# EAGLE design Go!Copter (EAGLE 6.1)
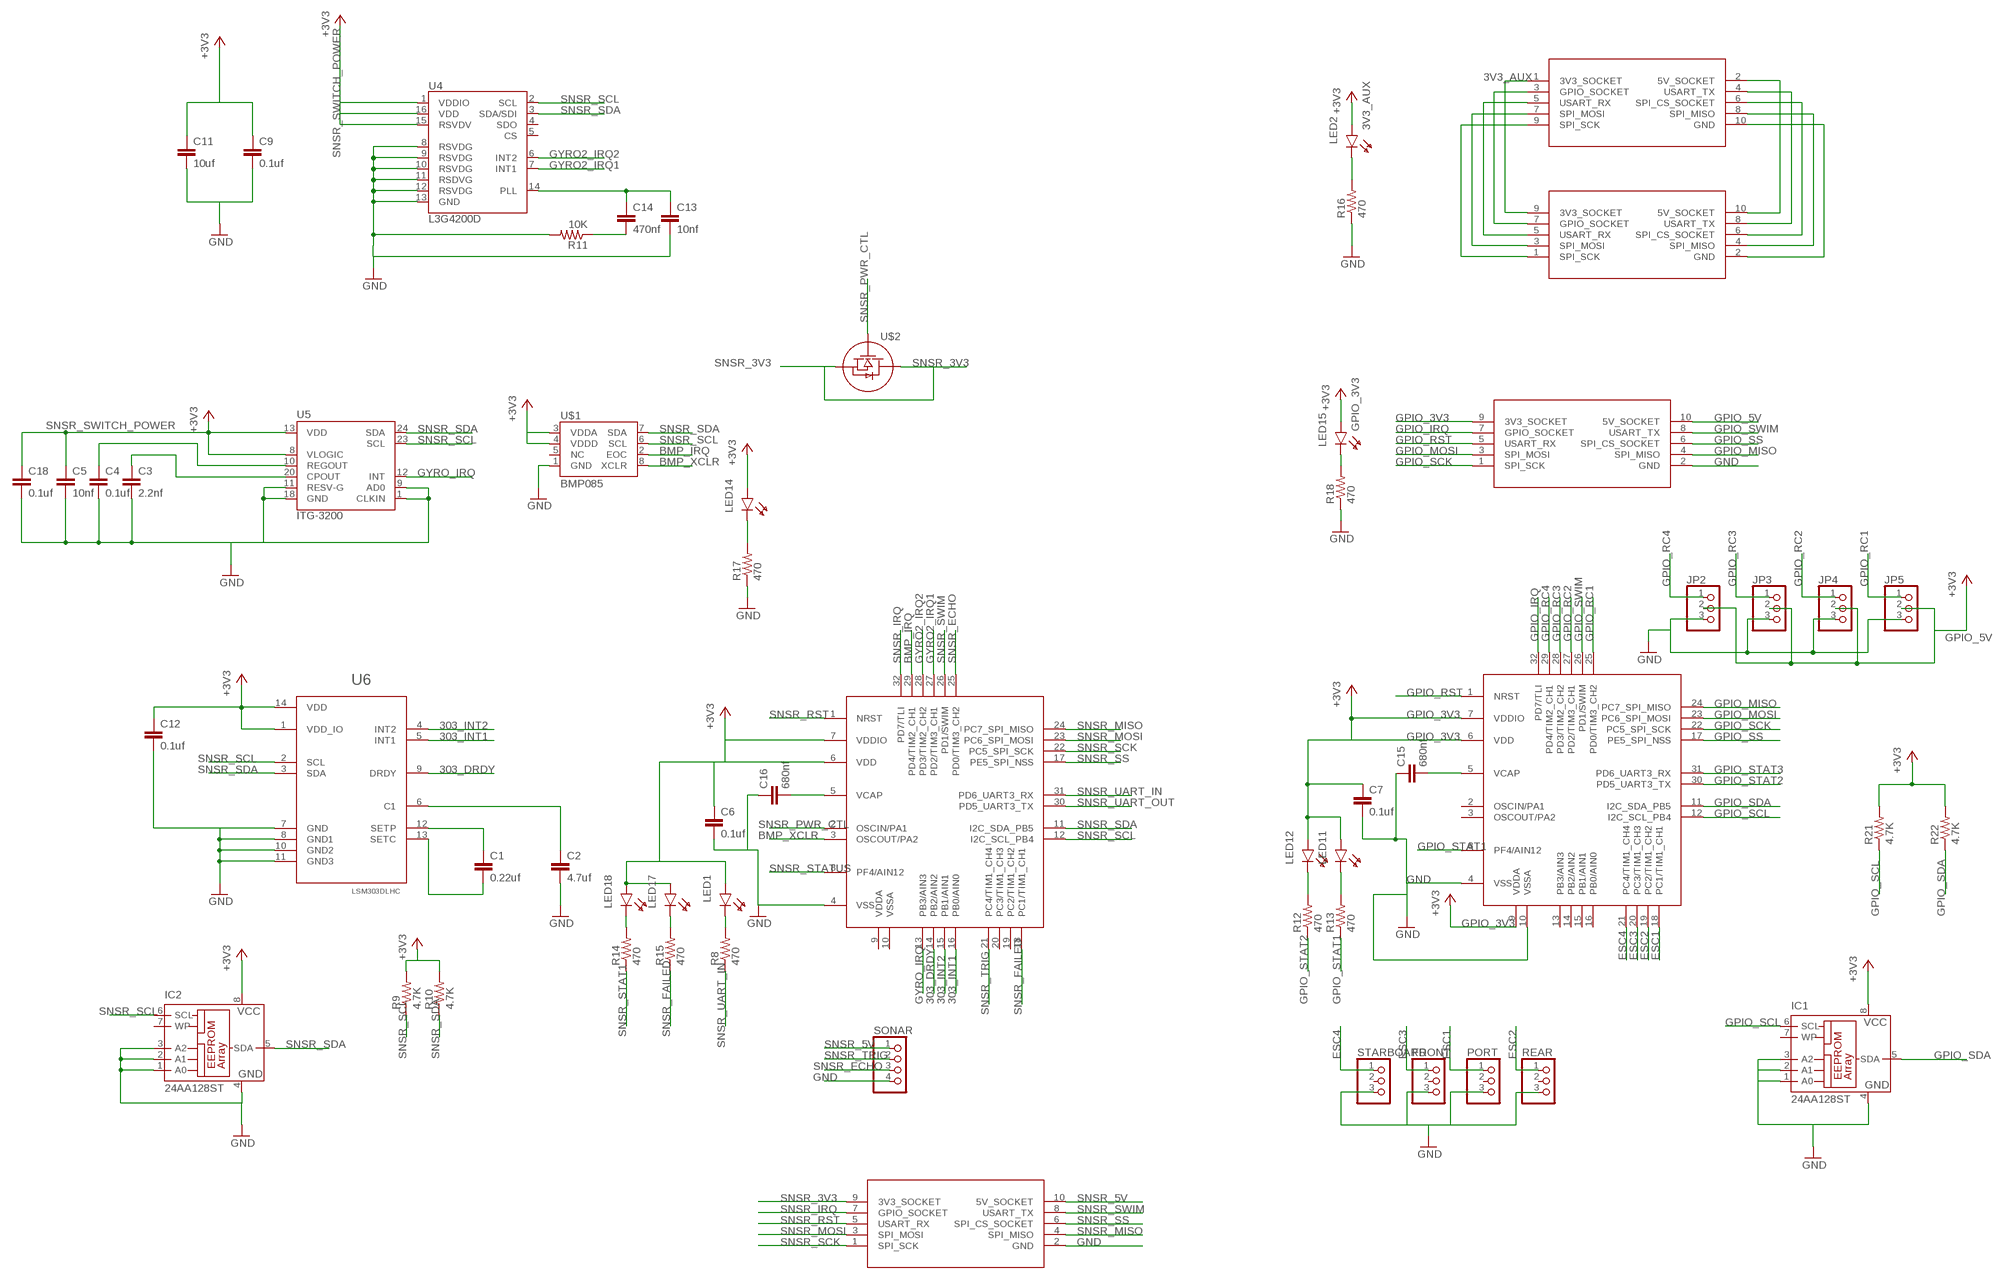
[diagram p0: schematic, sheet 1, part 1 of 2]
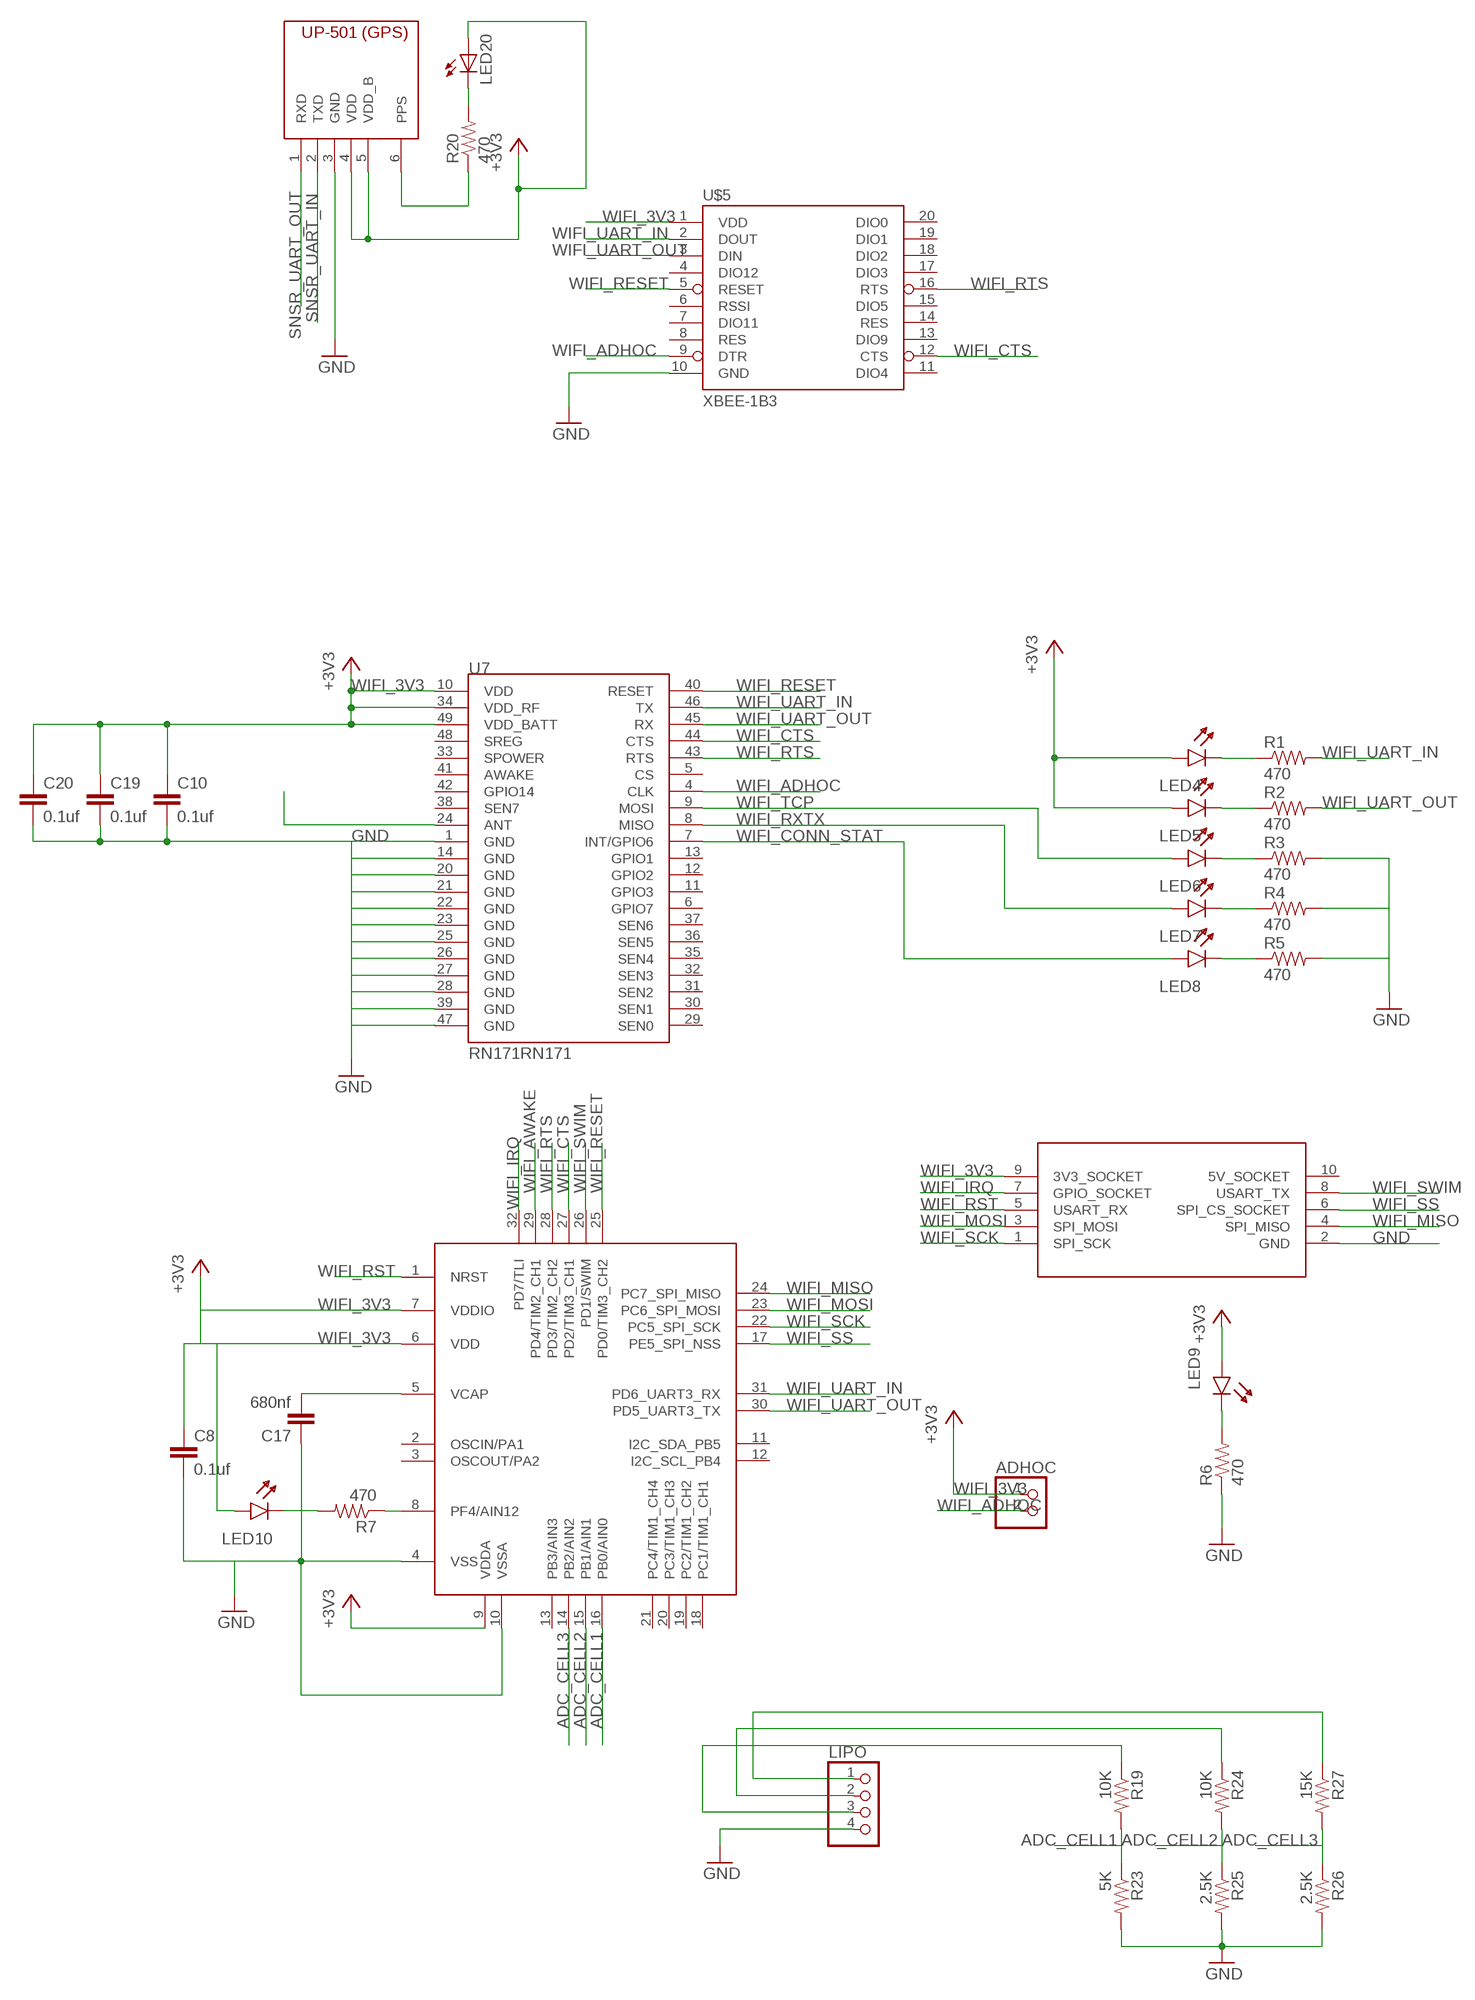
[diagram p1: schematic, sheet 1, part 2 of 2]

## Parts
ADHOC  PINHD-1X2  [1X02]
C1  0.22uf  CAP0805  [0805]
C2  4.7uf  CAP0805  [0805]
C3  2.2nf  CAP0805  [0805]
C4  0.1uf  CAP0805  [0805]
C5  10nf  CAP0805  [0805]
C6  0.1uf  CAP0805  [0805]
C7  0.1uf  CAP0805  [0805]
C8  0.1uf  CAP0805  [0805]
C9  0.1uf  CAP0805  [0805]
C10  0.1uf  CAP0805  [0805]
C11  10uf  CAP0805  [0805]
C12  0.1uf  CAP0805  [0805]
C13  10nf  CAP0805  [0805]
C14  470nf  CAP0805  [0805]
C15  680nf  CAP0805  [0805]
C16  680nf  CAP0805  [0805]
C17  680nf  CAP0805  [0805]
C18  0.1uf  CAP0805  [0805]
C19  0.1uf  CAP0805  [0805]
C20  0.1uf  CAP0805  [0805]
FRONT  PINHD-1X3  [1X03]
IC1  24AA128ST  [TSSOP8]
IC2  24AA128ST  [TSSOP8]
JP2  PINHD-1X3  [1X03]
JP3  PINHD-1X3  [1X03]
JP4  PINHD-1X3  [1X03]
JP5  PINHD-1X3  [1X03]
LED1  SMD_LED0805  [LED0805]
LED2  SMD_LED0805  [LED0805]
LED4  SMD_LED0805  [LED0805]
LED5  SMD_LED0805  [LED0805]
LED6  SMD_LED0805  [LED0805]
LED7  SMD_LED0805  [LED0805]
LED8  SMD_LED0805  [LED0805]
LED9  SMD_LED0805  [LED0805]
LED10  SMD_LED0805  [LED0805]
LED11  SMD_LED0805  [LED0805]
LED12  SMD_LED0805  [LED0805]
LED14  SMD_LED0805  [LED0805]
LED15  SMD_LED0805  [LED0805]
LED17  SMD_LED0805  [LED0805]
LED18  SMD_LED0805  [LED0805]
LED20  LEDCHIPLED_0805  [CHIPLED_0805]
LIPO  PINHD-1X4  [1X04]
PORT  PINHD-1X3  [1X03]
R1  470  RESISTOR0805-RES  [0805]
R2  470  RESISTOR0805-RES  [0805]
R3  470  RESISTOR0805-RES  [0805]
R4  470  RESISTOR0805-RES  [0805]
R5  470  RESISTOR0805-RES  [0805]
R6  470  RESISTOR0805-RES  [0805]
R7  470  RESISTOR0805-RES  [0805]
R8  470  RESISTOR0805-RES  [0805]
R9  4.7K  RESISTOR0805-RES  [0805]
R10  4.7K  RESISTOR0805-RES  [0805]
R11  10K  RESISTOR0805-RES  [0805]
R12  470  RESISTOR0805-RES  [0805]
R13  470  RESISTOR0805-RES  [0805]
R14  470  RESISTOR0805-RES  [0805]
R15  470  RESISTOR0805-RES  [0805]
R16  470  RESISTOR0805-RES  [0805]
R17  470  RESISTOR0805-RES  [0805]
R18  470  RESISTOR0805-RES  [0805]
R19  10K  RESISTOR0805-RES  [0805]
R20  470  RESISTOR0805-RES  [0805]
R21  4.7K  RESISTOR0805-RES  [0805]
R22  4.7K  RESISTOR0805-RES  [0805]
R23  5K  RESISTOR0805-RES  [0805]
R24  10K  RESISTOR0805-RES  [0805]
R25  2.5K  RESISTOR0805-RES  [0805]
R26  2.5K  RESISTOR0805-RES  [0805]
R27  15K  RESISTOR0805-RES  [0805]
REAR  PINHD-1X3  [1X03]
SONAR  PINHD-1X4  [1X04]
STARBOARD  PINHD-1X3  [1X03]
U1  STM8S207K6  [LQFP32]
U2  STM8S207K6  [LQFP32]
U3  STM8S207K6  [LQFP32]
U4  L3G4200D  [LGA16-4X4]
U5  ITG-3200  [QFN-24]
U6  LSM303DLHC  [LGA3X5X1-14L]
U7  RN171RN171  [RN171]
U$1  BMP085  [BMP085]
U$2  MOSFET-BSS138  [SOT-23]
U$3  GO!BUS-FEMALE  [PIN2ROW_0.05"]
U$4  GO!BUS-FEMALE  [PIN2ROW_0.05"]
U$5  XBEE-1B3  [XBEE-SMD]
U$6  UP501  [UP-501]
U$7  GO!BUS-FEMALE  [PIN2ROW_0.05"]
U$8  GO!BUS-FEMALE  [PIN2ROW_0.05"]
U$9  GO!BUS  [PIN2ROW_0.05"]

## Nets
3V3_AUX: LED2.P$1(A) U$8.9(3V3_SOCKET) U$9.1(3V3_SOCKET) ; supply symbol labelled +3V3
5V_AUX: U$8.10(5V_SOCKET) U$9.2(5V_SOCKET)
303_DRDY: U1.14(PB2/AIN2) U6.9(DRDY)
303_INT1: U1.16(PB0/AIN0) U6.5(INT1)
303_INT2: U1.15(PB1/AIN1) U6.4(INT2)
+3V3: U3.9(VDDA)
ADC_CELL1: R19.2 R23.1 U3.16(PB0/AIN0)
ADC_CELL2: R24.2 R25.1 U3.15(PB1/AIN1)
ADC_CELL3: R26.1 R27.2 U3.14(PB2/AIN2)
ANTENNA: U7.24(ANT)
BMP_IRQ: U1.29(PD4/TIM2_CH1) U$1.2(EOC)
BMP_XCLR: U1.3(OSCOUT/PA2) U$1.8(XCLR)
ESC1: PORT.1 U2.18(PC1/TIM1_CH1)
ESC2: REAR.1 U2.19(PC2/TIM1_CH2)
ESC3: FRONT.1 U2.20(PC3/TIM1_CH3)
ESC4: STARBOARD.1 U2.21(PC4/TIM1_CH4)
GND: C2.2 C3.2 C4.2 C5.2 C6.2 C7.2 C8.2 C9.2 C10.2 C11.2 C12.2 C13.2 C15.1 C16.1 C17.1 C18.2 C19.2 C20.2 FRONT.3 IC1.1(A0) IC1.2(A1) IC1.3(A2) IC1.4(GND) IC2.1(A0) IC2.2(A1) IC2.3(A2) IC2.4(GND) JP2.3 JP3.3 JP4.3 JP5.3 LIPO.4 PORT.3 R3.2 R4.2 R5.2 R6.1 R11.2 R16.1 R17.1 R18.1 R23.2 R25.2 R26.2 REAR.3 SONAR.4 STARBOARD.3 U1.4(VSS) U2.4(VSS) U2.10(VSSA) U3.4(VSS) U3.10(VSSA) U4.8(RSVDG) U4.9(RSVDG) U4.10(RSVDG) U4.11(RSDVG) U4.12(RSVDG) U4.13(GND) U5.1(CLKIN) U5.9(AD0) U5.11(RESV-G) U5.18(GND) U6.7(GND) U6.8(GND1) U6.10(GND2) U6.11(GND3) U7.1(GND) U7.14(GND) U7.20(GND) U7.21(GND) U7.22(GND) U7.23(GND) U7.25(GND) U7.26(GND) U7.27(GND) U7.28(GND) U7.39(GND) U7.47(GND) U$1.1(GND) U$3.2(GND) U$4.2(GND) U$5.10(GND) U$6.3(GND) U$7.2(GND) U$8.2(GND) U$9.10(GND)
GPIO_3V3: C7.1 IC1.8(VCC) LED11.P$1(A) LED12.P$1(A) LED15.P$1(A) R21.2 R22.2 U2.6(VDD) U2.7(VDDIO) U2.9(VDDA) U$3.9(3V3_SOCKET) ; supply symbol labelled +3V3
GPIO_5V: JP2.2 JP3.2 JP4.2 JP5.2 U$3.10(5V_SOCKET) ; supply symbol labelled +3V3
GPIO_IRQ: U2.32(PD7/TLI) U$3.7(GPIO_SOCKET)
GPIO_MISO: U2.24(PC7_SPI_MISO) U$3.4(SPI_MISO)
GPIO_MOSI: U2.23(PC6_SPI_MOSI) U$3.3(SPI_MOSI)
GPIO_RC1: JP5.1 U2.25(PD0/TIM3_CH2)
GPIO_RC2: JP4.1 U2.27(PD2/TIM3_CH1)
GPIO_RC3: JP3.1 U2.28(PD3/TIM2_CH2)
GPIO_RC4: JP2.1 U2.29(PD4/TIM2_CH1)
GPIO_RST: U2.1(NRST) U$3.5(USART_RX)
GPIO_SCK: U2.22(PC5_SPI_SCK) U$3.1(SPI_SCK)
GPIO_SCL: IC1.6(SCL) R21.1 U2.12(I2C_SCL_PB4)
GPIO_SDA: IC1.5(SDA) R22.1 U2.11(I2C_SDA_PB5)
GPIO_SS: U2.17(PE5_SPI_NSS) U$3.6(SPI_CS_SOCKET)
GPIO_STAT1: R13.1 U2.8(PF4/AIN12)
GPIO_STAT2: R12.1 U2.30(PD5_UART3_TX)
GPIO_STAT3: U2.31(PD6_UART3_RX)
GPIO_SWIM: U2.26(PD1/SWIM) U$3.8(USART_TX)
GYRO2_IRQ1: U1.27(PD2/TIM3_CH1) U4.7(INT1)
GYRO2_IRQ2: U1.28(PD3/TIM2_CH2) U4.6(INT2)
GYRO_IRQ: U1.13(PB3/AIN3) U5.12(INT)
N$1: LED18.C R14.2
N$3: LED1.C R8.2
N$4: C4.1 U5.10(REGOUT)
N$5: C3.1 U5.20(CPOUT)
N$6: LED4.C R1.1
N$7: C1.1 U6.12(SETP)
N$8: C1.2 U6.13(SETC)
N$9: C2.1 U6.6(C1)
N$10: LED5.C R2.1
N$11: LED6.C R3.1
N$12: LED7.C R4.1
N$13: LED8.C R5.1
N$14: LED9.C R6.2
N$16: LED10.C R7.2
N$17: R7.1 U3.8(PF4/AIN12)
N$18: LED17.C R15.2
N$19: LED15.C R18.2
N$20: LED2.C R16.2
N$21: LED12.C R12.2
N$22: LED11.C R13.2
N$23: U$8.7(GPIO_SOCKET) U$9.3(GPIO_SOCKET)
N$24: LED14.C R17.2
N$25: U$8.5(USART_RX) U$9.5(USART_RX)
N$27: U$8.3(SPI_MOSI) U$9.7(SPI_MOSI)
N$28: R20.1 U$6.6(PPS)
N$30: C15.2 U2.5(VCAP)
N$31: U$8.1(SPI_SCK) U$9.9(SPI_SCK)
N$32: LED20.C R20.2
N$33: C16.2 U1.5(VCAP)
N$34: C17.2 U3.5(VCAP)
N$37: C14.2 R11.1
N$38: U$8.8(USART_TX) U$9.4(USART_TX)
N$39: U$8.6(SPI_CS_SOCKET) U$9.6(SPI_CS_SOCKET)
N$40: U$8.4(SPI_MISO) U$9.8(SPI_MISO)
N$42: C13.1 C14.1 U4.14(PLL)
N$46: LIPO.3 R19.1
N$47: LIPO.2 R24.1
N$48: LIPO.1 R27.1
SNSR_3V3: C6.1 IC2.8(VCC) LED1.P$1(A) LED14.P$1(A) LED17.P$1(A) LED18.P$1(A) LED20.A R9.2 R10.2 U1.6(VDD) U1.7(VDDIO) U$2.BOTTOM_RIGHT(S) U$2.TOP(D) U$6.4(VDD) U$6.5(VDD_B) U$7.9(3V3_SOCKET) ; supply symbol labelled +3V3
SNSR_5V: SONAR.1 U$7.10(5V_SOCKET)
SNSR_ECHO: SONAR.3 U1.25(PD0/TIM3_CH2)
SNSR_FAILED: R15.1 U1.18(PC1/TIM1_CH1)
SNSR_IRQ: U1.32(PD7/TLI) U$7.7(GPIO_SOCKET)
SNSR_MISO: U1.24(PC7_SPI_MISO) U$7.4(SPI_MISO)
SNSR_MOSI: U1.23(PC6_SPI_MOSI) U$7.3(SPI_MOSI)
SNSR_PWR_CTL: U1.2(OSCIN/PA1) U$2.BOTTOM_LEFT(G)
SNSR_RST: U1.1(NRST) U$7.5(USART_RX)
SNSR_SCK: U1.22(PC5_SPI_SCK) U$7.1(SPI_SCK)
SNSR_SCL: IC2.6(SCL) R9.1 U1.12(I2C_SCL_PB4) U4.2(SCL) U5.23(SCL) U6.2(SCL) U$1.6(SCL)
SNSR_SDA: IC2.5(SDA) R10.1 U1.11(I2C_SDA_PB5) U4.3(SDA/SDI) U5.24(SDA) U6.3(SDA) U$1.7(SDA)
SNSR_SS: U1.17(PE5_SPI_NSS) U$7.6(SPI_CS_SOCKET)
SNSR_STAT1: R14.1
SNSR_STATUS: U1.8(PF4/AIN12)
SNSR_SWIM: U1.26(PD1/SWIM) U$7.8(USART_TX)
SNSR_SWITCH_POWER: C5.1 C9.1 C11.1 C12.1 C18.1 U4.1(VDDIO) U4.15(RSVDV) U4.16(VDD) U5.8(VLOGIC) U5.13(VDD) U6.1(VDD_IO) U6.14(VDD) U$1.3(VDDA) U$1.4(VDDD) ; supply symbol labelled +3V3
SNSR_TRIG: SONAR.2 U1.21(PC4/TIM1_CH4)
SNSR_UART_IN: R8.1 U1.31(PD6_UART3_RX) U$6.2(TXD)
SNSR_UART_OUT: U1.30(PD5_UART3_TX) U$6.1(RXD)
WIFI_3V3: ADHOC.1 C8.1 C10.1 C19.1 C20.1 LED4.P$1(A) LED5.P$1(A) LED9.P$1(A) LED10.P$1(A) U3.6(VDD) U3.7(VDDIO) U7.10(VDD) U7.34(VDD_RF) U7.49(VDD_BATT) U$4.9(3V3_SOCKET) U$5.1(VDD) ; supply symbol labelled +3V3
WIFI_ADHOC: ADHOC.2 U7.4(CLK) U$5.9(DTR)
WIFI_AWAKE: U3.29(PD4/TIM2_CH1)
WIFI_CONN_STAT: LED8.P$1(A) U7.7(INT/GPIO6)
WIFI_CTS: U3.27(PD2/TIM3_CH1) U7.44(CTS) U$5.12(CTS)
WIFI_IRQ: U3.32(PD7/TLI) U$4.7(GPIO_SOCKET)
WIFI_MISO: U3.24(PC7_SPI_MISO) U$4.4(SPI_MISO)
WIFI_MOSI: U3.23(PC6_SPI_MOSI) U$4.3(SPI_MOSI)
WIFI_RESET: U3.25(PD0/TIM3_CH2) U7.40(RESET) U$5.5(RESET)
WIFI_RST: U3.1(NRST) U$4.5(USART_RX)
WIFI_RTS: U3.28(PD3/TIM2_CH2) U7.43(RTS) U$5.16(RTS)
WIFI_RXTX: LED7.P$1(A) U7.8(MISO)
WIFI_SCK: U3.22(PC5_SPI_SCK) U$4.1(SPI_SCK)
WIFI_SS: U3.17(PE5_SPI_NSS) U$4.6(SPI_CS_SOCKET)
WIFI_SWIM: U3.26(PD1/SWIM) U$4.8(USART_TX)
WIFI_TCP: LED6.P$1(A) U7.9(MOSI)
WIFI_UART_IN: R1.2 U3.31(PD6_UART3_RX) U7.46(TX) U$5.2(DOUT)
WIFI_UART_OUT: R2.2 U3.30(PD5_UART3_TX) U7.45(RX) U$5.3(DIN)
Unconnected: FRONT.2 IC1.7(WP) IC2.7(WP) PORT.2 REAR.2 STARBOARD.2 U1.9(VDDA) U1.10(VSSA) U1.19(PC2/TIM1_CH2) U1.20(PC3/TIM1_CH3) U2.2(OSCIN/PA1) U2.3(OSCOUT/PA2) U2.13(PB3/AIN3) U2.14(PB2/AIN2) U2.15(PB1/AIN1) U2.16(PB0/AIN0) U3.2(OSCIN/PA1) U3.3(OSCOUT/PA2) U3.11(I2C_SDA_PB5) U3.12(I2C_SCL_PB4) U3.13(PB3/AIN3) U3.18(PC1/TIM1_CH1) U3.19(PC2/TIM1_CH2) U3.20(PC3/TIM1_CH3) U3.21(PC4/TIM1_CH4) U4.4(SDO) U4.5(CS) U7.5(CS) U7.6(GPIO7) U7.11(GPIO3) U7.12(GPIO2) U7.13(GPIO1) U7.29(SEN0) U7.30(SEN1) U7.31(SEN2) U7.32(SEN3) U7.33(SPOWER) U7.35(SEN4) U7.36(SEN5) U7.37(SEN6) U7.38(SEN7) U7.41(AWAKE) U7.42(GPIO14) U7.48(SREG) U$1.5(NC) U$5.4(DIO12) U$5.6(RSSI) U$5.7(DIO11) U$5.8(RES) U$5.11(DIO4) U$5.13(DIO9) U$5.14(RES) U$5.15(DIO5) U$5.17(DIO3) U$5.18(DIO2) U$5.19(DIO1) U$5.20(DIO0)

## Power pins joined to a net without a drawn wire
5V_SOCKET: U$4.10(5V_SOCKET)

## Library data of the parts
ADHOC = pinhead:PINHD-1X2: PIN HEADER
C1-C20 = SparkFun-Passives:CAP: Capacitor Standard 0603 ceramic capacitor, and 0.1" leaded capacitor.
FRONT JP2-JP5 PORT REAR STARBOARD = pinhead:PINHD-1X3: PIN HEADER
IC1 IC2 = microchip:24*: Serial EEPROM I2C; MF: MICROCHIP; MPN: 24AA128-I/ST; OC_FARNELL: unknown; OC_NEWARK: 92C6843
LED1 LED2 LED4-LED12 LED14 LED15 LED17 LED18 = SoftwareLogisticsParts:SMD_LED0805
LED20 = led:LED: LED OSRAM: - CHIPLED LG R971, LG N971, LY N971, LG Q971, LY Q971, LO R971, LY R971 LH N974, LH R974 LS Q976, LO Q976, LY Q976 LO Q996 - Hyper CHIPLED LW Q18S LB Q993, LB Q99A, LB R99A - SideLED LS A670, LO A670, LY A670, LG A670, LP A670 LB A673, LV A673, LT A673, LW A673 LH A674 LY A675 LS A676, LA A676, LO A676, LY A676, LW A676 LS A679, LY A679, LG A679 - Hyper Micro SIDELED® LS Y876, LA Y876, LO Y876, LY Y876 LT Y87S - SmartLED LW L88C, LW L88S LB L89C, LB L89S, LG L890 LS L89K, LO L89K, LY L89K LS L896, LA L896, LO L896, LY L896 - TOPLED LS T670, LO T670, LY T670, LG T670, LP T670 LSG T670, LSP T670, LSY T670, LOP T670, LYG T670 LG T671, LOG T671, LSG T671 LB T673, LV T673, LT T673, LW T673 LH T674 LS T676, LA T676, LO T676, LY T676, LB T676, LH T676, LSB T676, LW T676 LB T67C, LV T67C, LT T67C, LS T67K, LO T67K, LY T67K, LW E67C LS E67B, LA E67B, LO E67B, LY E67B, LB E67C, LV E67C, LT E67C LW T67C LS T679, LY T679, LG T679 LS T770, LO T770, LY T770, LG T770, LP T770 LB T773, LV T773, LT T773, LW T773 LH T774 LS E675, LA E675, LY E675, LS T675 LS T776, LA T776, LO T776, LY T776, LB T776 LHGB T686 LT T68C, LB T68C - Hyper Mini TOPLED® LB M676 - Mini TOPLED Santana® LG M470 LS M47K, LO M47K, LY M47K Source: http://www.osram.convergy.de LUXEON: - LUMILED® LXK2-PW12-R00, LXK2-PW12-S00, LXK2-PW14-U00, LXK2-PW14-V00 LXK2-PM12-R00, LXK2-PM12-S00, LXK2-PM14-U00 LXK2-PE12-Q00, LXK2-PE12-R00, LXK2-PE12-S00, LXK2-PE14-T00, LXK2-PE14-U00 LXK2-PB12-K00, LXK2-PB12-L00, LXK2-PB12-M00, LXK2-PB14-N00, LXK2-PB14-P00, LXK2-PB14-Q00 LXK2-PR12-L00, LXK2-PR12-M00, LXK2-PR14-Q00, LXK2-PR14-R00 LXK2-PD12-Q00, LXK2-PD12-R00, LXK2-PD12-S00 LXK2-PH12-R00, LXK2-PH12-S00 LXK2-PL12-P00, LXK2-PL12-Q00, LXK2-PL12-R00 Source: www.luxeon.com KINGBRIGHT: KA-3528ASYC Source: www.kingbright.com
LIPO SONAR = pinhead:PINHD-1X4: PIN HEADER
R1-R27 = SparkFun-Passives:RESISTOR: Resistor Basic schematic elements and footprints for 0603, 1206, and PTH resistors.
U1-U3 = SoftwareLogisticsParts:STM8S207K6: STM8 32K FLASH 6KRAM 32 Pin
U4 = SparkFun-Sensors:L3G4200D: L3G4200D Three-axis, digital output gyroscope The L3G4200D is a low-power three-axis angular rate sensor, has a full scale of ±250/±500/±2000 dps and is capable of measuring rates with a user-selectable bandwidth. It includes a sensing element and an IC interface capable of providing the measured angular rate to the external world through a digital interface (I2C/SPI). Package: 4x4x1.1 LGA-16 (LGA16-4x4.PAC)
U5 = SparkFun-Sensors:ITG-3200: ITG-3200 3-axis gyro, digital output, qfn24 package
U6 = SoftwareLogisticsParts:LSM303DLHC: 3D Accelerometer and 3D Magenetometer Module ST Micro Electronics
U7 = SparkFun-RF:RN171: WiFi Module
U$1 = SparkFun-Sensors:BMP085: BMP085 Pressure Sensor Great little MEMS pressure sensor. SKU: COM-09603
U$2 = SoftwareLogisticsParts:MOSFET-BSS138
U$3 U$4 U$7 U$8 = SoftwareLogisticsParts:GO!BUS-FEMALE
U$5 = SparkFun-RF:XBEE-1: Xbee module footprints
U$6 = SoftwareLogisticsParts:UP501
U$9 = SoftwareLogisticsParts:GO!BUS

## Board
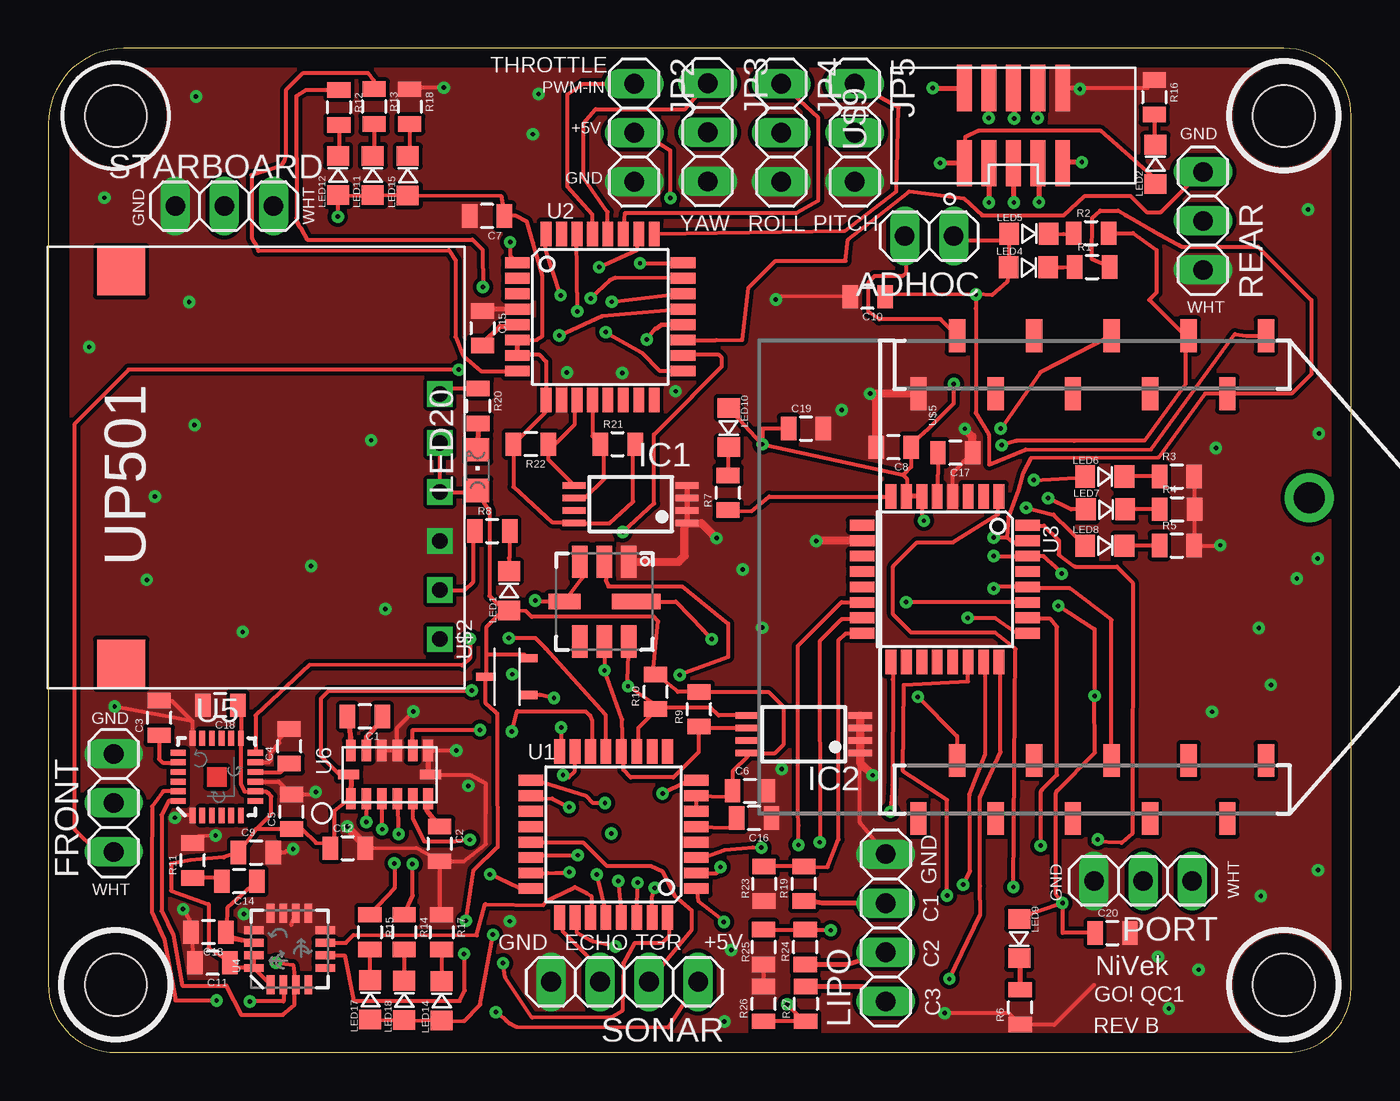
[diagram p2: board, top side]
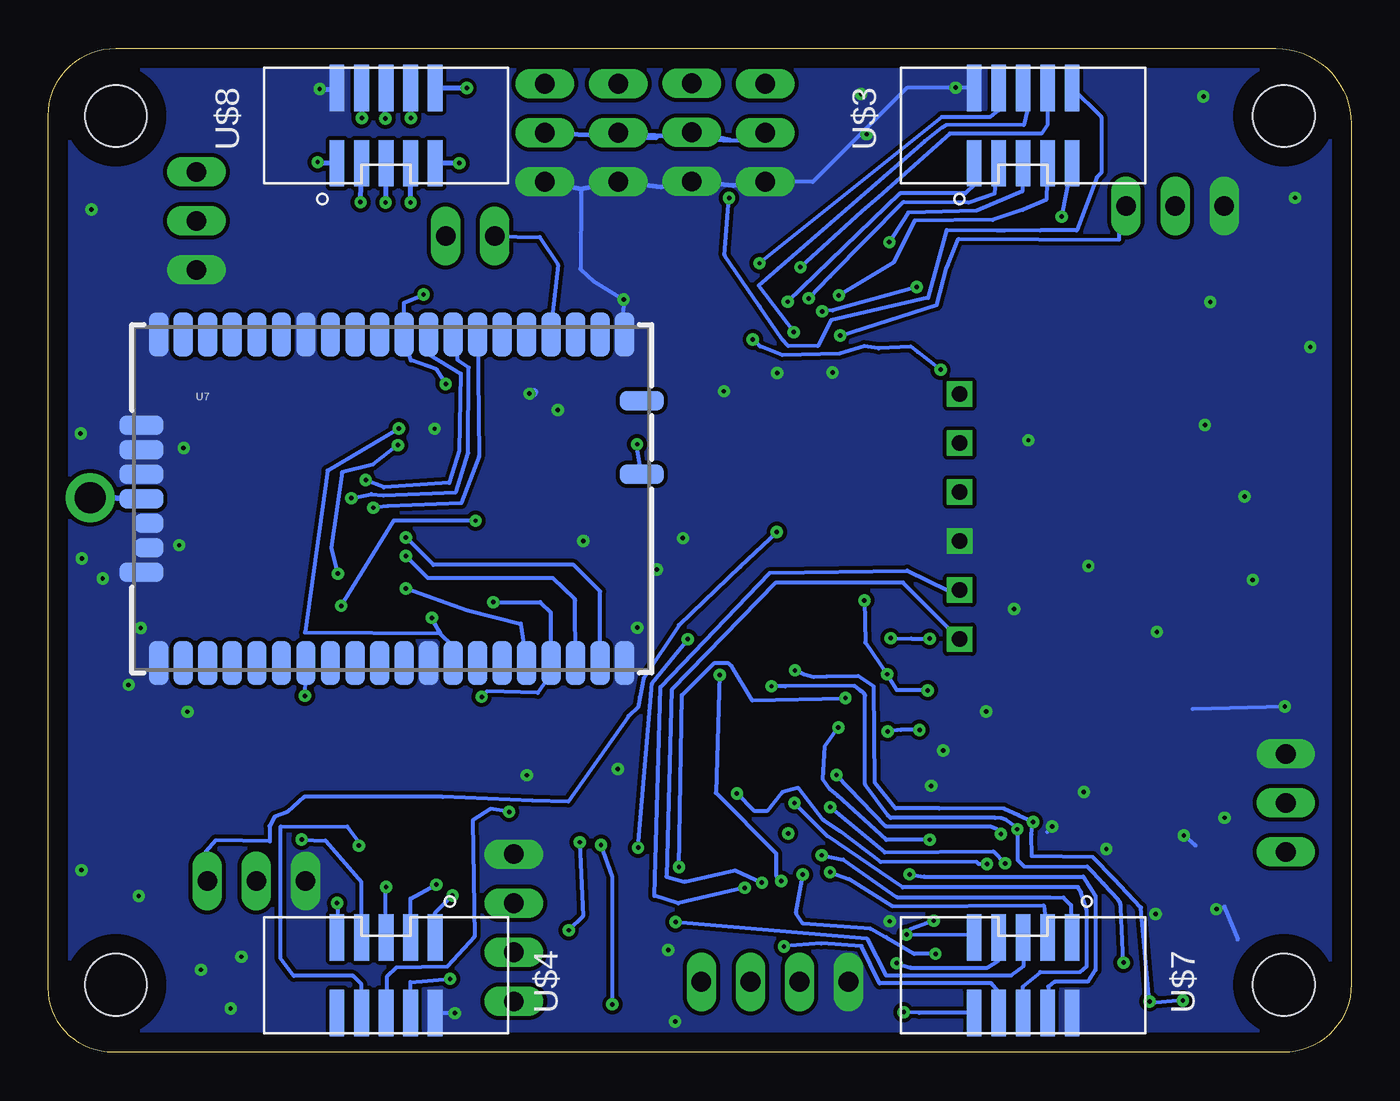
[diagram p3: board, bottom side, seen from below]

Size 67.5 x 52 mm. Coordinates in mm from the lower left corner, seen from the top.
Outline: 64,52 3.91,52 arc90 0,48.09 0,3.52 arc90 3.52,0 64.15,0 arc90 67.5,3.35 67.5,48.5 arc90 64,52
Copper layers (1*16): Top 0.035mm / dielectric 1.5mm / Bottom 0.035mm
Design rules: minimum track width 8mil, minimum drill 9mil, track to track 8mil, track to pad 8mil, pad to pad 8mil, via to via 8mil, smd to smd 8mil, copper to edge 40mil, drill to drill 8mil, minimum pad ring 10mil, minimum via ring 8mil, stop-mask expansion 4mil, vias tented up to drill 9mil, thermal gap 10mil
Holes 3.2 mm at 3.5,48.5 64,48.5 3.5,3.5 64,3.5

### Footprints (pad centres in the part's own frame; a part is rotated, then mirrored left to right if it is on the bottom)
1X02 = drill 1.016 long: 1 -1.27,0; 2 1.27,0
0805 = smd 0.8 x 1.2: 1 -0.9,0; 2 0.9,0
1X03 = drill 1.016 long: 1 -2.54,0; 2 0,0; 3 2.54,0
TSSOP8 = smd 0.35 x 1.2: 1 -0.975,-2.925; 2 -0.325,-2.925; 3 0.325,-2.925; 4 0.975,-2.925; 5 0.975,2.925; 6 0.325,2.925; 7 -0.325,2.925; 8 -0.975,2.925
LED0805 = smd 1.143 x 1.016: C 0,1.016; P$1 0,-1.016
CHIPLED_0805 = smd 1.2 x 1.2: A 0,-1.05; C 0,1.05
1X04 = drill 1.016 long: 1 -3.81,0; 2 -1.27,0; 3 1.27,0; 4 3.81,0
LQFP32 = smd 1.27 x 0.559: 1 -4.293,2.8; 2 -4.293,2; 3 -4.293,1.2; 4 -4.293,0.4; 5 -4.293,-0.4; 6 -4.293,-1.2; 7 -4.293,-2; 8 -4.293,-2.8; 17 4.293,-2.8; 18 4.293,-2; 19 4.293,-1.2; 20 4.293,-0.4; 21 4.293,0.4; 22 4.293,1.2; 23 4.293,2; 24 4.293,2.8 | smd 0.559 x 1.27: 9 -2.8,-4.293; 10 -2,-4.293; 11 -1.2,-4.293; 12 -0.4,-4.293; 13 0.4,-4.293; 14 1.2,-4.293; 15 2,-4.293; 16 2.8,-4.293; 25 2.8,4.293; 26 2,4.293; 27 1.2,4.293; 28 0.4,4.293; 29 -0.4,4.293; 30 -1.2,4.293; 31 -2,4.293; 32 -2.8,4.293
LGA16-4X4 = smd 1 x 0.4: 1 -1.85,0.975; 2 -1.85,0.325; 3 -1.85,-0.325; 4 -1.85,-0.975; 9 1.85,-0.975; 10 1.85,-0.325; 11 1.85,0.325; 12 1.85,0.975 | smd 0.4 x 1: 5 -0.975,-1.85; 6 -0.325,-1.85; 7 0.325,-1.85; 8 0.975,-1.85; 13 0.975,1.85; 14 0.325,1.85; 15 -0.325,1.85; 16 -0.975,1.85
QFN-24 = smd 0.8 x 0.3: 1 -2,1.25; 2 -2,0.75; 3 -2,0.25; 4 -2,-0.25; 5 -2,-0.75; 6 -2,-1.25; 13 2,-1.25; 14 2,-0.75; 15 2,-0.25; 16 2,0.25; 17 2,0.75; 18 2,1.25 | smd 0.3 x 0.8: 7 -1.25,-2; 8 -0.75,-2; 9 -0.25,-2; 10 0.25,-2; 11 0.75,-2; 12 1.25,-2; 19 1.25,2; 20 0.75,2; 21 0.25,2; 22 -0.25,2; 23 -0.75,2; 24 -1.25,2
LGA3X5X1-14L = smd 1.1 x 0.5: 1 -1.25,2; 2 -1.25,1.2; 3 -1.25,0.4; 4 -1.25,-0.4; 5 -1.25,-1.2; 6 -1.25,-2; 8 1.25,-2; 9 1.25,-1.2; 10 1.25,-0.4; 11 1.25,0.4; 12 1.25,1.2; 13 1.25,2 | smd 0.5 x 1.1: 7 0,-2.125; 14 0,2.125
RN171 = smd 1.016 x 2.286: 1 12.065,8.509; 2 10.795,8.509; 3 9.525,8.509; 4 8.255,8.509; 5 6.985,8.509; 6 5.715,8.509; 7 4.445,8.509; 8 3.175,8.509; 9 1.905,8.509; 10 0.635,8.509; 11 -0.635,8.509; 12 -1.905,8.509; 13 -3.175,8.509; 14 -4.445,8.509; 15 -5.715,8.509; 16 -6.985,8.509; 17 -8.255,8.509; 18 -9.525,8.509; 19 -10.795,8.509; 20 -12.065,8.509; 28 -12.065,-8.509; 29 -10.795,-8.509; 30 -9.525,-8.509; 31 -8.255,-8.509; 32 -6.985,-8.509; 33 -5.715,-8.509; 34 -4.445,-8.509; 35 -3.175,-8.509; 36 -1.905,-8.509; 37 -0.635,-8.509; 38 0.635,-8.509; 39 1.905,-8.509; 40 3.175,-8.509; 41 4.445,-8.509; 42 5.715,-8.509; 43 6.985,-8.509; 44 8.255,-8.509; 45 9.525,-8.509; 46 10.795,-8.509; 47 12.065,-8.509 | smd 2.286 x 1.016: 21 -12.954,3.81; 22 -12.954,2.54; 23 -12.954,1.27; 24 -12.954,0; 27 -12.954,-3.81; 48 12.954,5.08; 49 12.954,1.27 | smd 1.524 x 1.016: 25 -12.573,-1.27; 26 -12.573,-2.54
BMP085 = smd 1.67 x 0.8: 1 -2.065,1.27; 2 -2.065,0; 3 -2.065,-1.27; 5 2.065,-1.27; 6 2.065,0; 7 2.065,1.27 | smd 0.8 x 1.67: 4 0,-2.065 | smd 0.8 x 2.5: 8 0,1.65
SOT-23 = smd 0.43 x 1: BOTTOM_LEFT -0.95,-1.1; BOTTOM_RIGHT 0.95,-1.1; TOP 0,1.1
PIN2ROW_0.05" = smd 2.4 x 0.76: 1 -1.95,2.54; 2 1.95,2.54; 3 -1.95,1.27; 4 1.95,1.27; 5 -1.95,0; 6 1.95,0; 7 -1.95,-1.27; 8 1.95,-1.27; 9 -1.95,-2.54; 10 1.95,-2.54
XBEE-SMD = smd 1.7 x 0.85: 1 -12.5,20; 2 -9.5,18; 3 -12.5,16; 4 -9.5,14; 5 -12.5,12; 6 -9.5,10; 7 -12.5,8; 8 -9.5,6; 9 -12.5,4; 10 -9.5,2; 11 12.5,2; 12 9.5,4; 13 12.5,6; 14 9.5,8; 15 12.5,10; 16 9.5,12; 17 12.5,14; 18 9.5,16; 19 12.5,18; 20 9.5,20
UP-501 = drill 0.8 square: 1 -8.89,-8.89; 2 -6.35,-8.89; 3 -3.81,-8.89; 4 -1.27,-8.89; 5 1.27,-8.89; 6 3.81,-8.89 | smd 2.5 x 2.5: 7 10.16,7.62; 8 -10.16,7.62

### Placement (x,y rotation side)
ADHOC  45.64,42.27 180 top
C1  16.4,17.4 180 top
C2  20.28,10.8 270 top
C3  5.74,17.33 90 top
C4  12.48,15.86 90 top
C5  12.6,12.46 90 top
C6  36.34,13.54 0 top
C7  22.73,43.32 180 top
C8  43.79,31.34 180 top
C9  10.76,10.36 0 top
C10  42.45,39.13 180 top
C11  8.51,4.64 180 top
C12  15.52,10.58 0 top
C13  8.3,6.23 180 top
C14  9.9,8.86 180 top
C15  22.5,37.5 270 top
C16  36.57,12.14 180 top
C17  46.99,31.05 180 top
C18  8.92,17.98 180 top
C19  39.26,32.31 0 top
C20  55.13,6.18 0 top
FRONT  3.39,12.92 90 top
IC1  30.17,28.39 90 top
IC2  39.13,16.47 90 top
JP2  30.35,47.62 270 top
JP3  34.16,47.65 270 top
JP4  37.97,47.62 270 top
JP5  41.78,47.62 270 top
LED1  23.86,23.9 0 top
LED2  57.35,45.99 0 top
LED4  50.78,40.66 270 top
LED5  50.8,42.4 270 top
LED6  54.73,29.83 270 top
LED7  54.77,28.12 270 top
LED8  54.73,26.24 270 top
LED9  50.3,5.9 180 top
LED10  35.25,32.36 180 top
LED11  16.81,45.41 0 top
LED12  15.01,45.41 0 top
LED14  20.37,2.67 0 top
LED15  18.62,45.4 0 top
LED17  16.68,2.72 0 top
LED18  18.44,2.69 0 top
LED20  22.25,30.15 0 top
LIPO  43.38,6.46 90 top
PORT  56.72,8.89 180 top
R1  54.07,40.68 0 top
R2  54.02,42.43 0 top
R3  58.46,29.83 0 top
R4  58.48,28.13 0 top
R5  58.47,26.25 0 top
R6  50.35,2.34 90 top
R7  35.21,28.98 90 top
R8  23,27 0 top
R9  33.71,17.77 90 top
R10  31.46,18.67 90 top
R11  7.48,9.94 90 top
R12  15.06,48.94 270 top
R13  16.88,48.98 270 top
R14  18.44,6.23 270 top
R15  16.66,6.23 270 top
R16  57.3,49.47 270 top
R17  20.37,6.23 270 top
R18  18.73,48.98 270 top
R19  39.14,8.74 90 top
R20  22.27,33.47 270 top
R21  29.5,31.5 0 top
R22  25,31.5 180 top
R23  37.08,8.74 270 top
R24  39.22,5.46 90 top
R25  37.06,5.46 270 top
R26  37.06,2.51 90 top
R27  39.24,2.51 270 top
REAR  59.82,43.06 270 top
SONAR  29.85,3.66 180 top
STARBOARD  9.13,43.82 180 top
U1  29.28,11.29 180 top
U2  28.59,38.09 0 top
U3  46.45,24.5 270 top
U4  12.5,5.35 90 top
U5  8.73,14.27 90 top
U6  17.68,14.39 90 top
U7  49.71,28.68 0 bottom
U$1  28.81,23.34 270 top
U$2  23.76,19.46 90 top
U$3  17,48 90 bottom
U$4  50,4 270 bottom
U$5  43.08,24.61 270 top
U$6  11.4,30.29 90 top
U$7  17,4 270 bottom
U$8  50,48 90 bottom
U$9  50,48 90 top

### Tracks (layer width: path | path; a pad name or v marks a point on that pad's centre or on a via)
3V3_AUX  (via drill 0.23)
  Top 0.203: LED2.P$1 57.35,45.24 54.53,47.73 48.18,47.73 47.5,47.4 47.5,46.09 U$9.1
  Top 0.254: U$9.1 v46.2,46.05 | v46.2,46.05
  Bottom 0.254: v46.2,46.05 U$9.1 | U$9.1
5V_AUX  (via drill 0.23)
  Top 0.254: v45.82,49.94 47.46,49.94 U$9.2
  Bottom 0.254: U$9.2 v45.82,49.95 v45.82,49.94
303_DRDY  (via drill 0.23)
  Top 0.203: U6.9 18.88,16.7 v22.36,16.7 | v24.02,16.62 24.3,17.68 27.84,17.67 28.07,17.44 28.18,17.17 28.17,15.54 U1.14
  Bottom 0.203: v22.36,16.7 23.34,16.7 23.52,16.69 23.96,16.66 v24.02,16.62
303_INT1  (via drill 0.23)
  Top 0.203: U6.5 18.88,12.12 19.48,10.94 21.07,10.94 21.16,10.96 v21.84,11.01 | v26.57,16.83 26.53,15.57 U1.16
  Bottom 0.203: v21.84,11.01 24.09,11.01 26.59,13.28 27,13.63 27.37,14.15 27.27,15.85 v26.57,16.83
303_INT2  (via drill 0.23)
  Top 0.203: v18.15,11.32 18.14,13.08 U6.4 | v26.67,14.36 26.96,14.25 27.28,14.57 27.28,15.54 27.29,15.56 27.29,15.57 U1.15
  Bottom 0.203: v26.67,14.36 24.13,11.72 21.37,11.71 18.68,11.71 18.38,11.58 18.06,11.21 v18.15,11.32
ADC_CELL1
  Top 0.203: R23.1 37.08,9.63 37.09,9.64 R19.2 40.37,9.6 40.95,11.04 40.93,21.34 41.31,21.7 U3.16
ADC_CELL2  (via drill 0.23)
  Top 0.203: R25.1 R24.2 39.25,6.33 v40.54,6.33 | U3.15 42.16,22.43 41.09,22.43 39.95,21.29 v39.97,10.88
  Bottom 0.203: v39.97,10.88 39.8,7.06 v40.54,6.33
ADC_CELL3  (via drill 0.23)
  Top 0.203: R26.1 R27.2 39.15,1.61 v38.28,2.49 | v38.86,10.74 38.88,11.75 38.84,12.51 38.84,21.06 41.1,23.32 42.15,23.32 U3.14
  Bottom 0.203: v38.28,2.49 38.28,9.09 v38.86,10.74
ANTENNA  (via drill 1.6 pad 2.54)
  Bottom 0.203: 65.3,28.72 65.75,28.7 v65.32,28.71
  Bottom 0.305: U7.24 65.3,28.72
BMP_IRQ  (via drill 0.23)
  Top 0.203: U$1.2 28.89,24.43 29.02,24.13 32.84,24.13 35.22,22.2 35.22,20.47 v32.72,19.55 | v29.53,8.88 29.7,7.13 U1.29
  Bottom 0.203: v32.72,19.55 32.92,13.44 29.79,10.31 29.79,9.16 29.58,8.94 29.41,8.94 v29.53,8.88
BMP_XCLR  (via drill 0.23)
  Top 0.203: U$1.8 32.51,23.34 33.91,21.88 v34.37,21.4 | U1.3 33.9,10.09 35.05,10.49 36.5,10.62 v36.94,10.6
  Bottom 0.203: v36.94,10.6 36.22,19.11 v34.37,21.4
ESC1  (via drill 0.23)
  Top 0.203: v29.76,26.95 31.38,28.43 31.37,31.99 33.35,33.96 33.33,33.95 34.9,35.52 34.9,35.97 34.75,36.12 32.91,36.12 U2.18
  Top 0.305: U2.18 32.74,36.09 32.66,36.02
  Bottom 0.203: v29.76,26.95 31.66,25.15 34.84,22.12 36.65,19.38 36.85,18.41 36.96,17.87 37.45,17.41 40.56,12.99 42.42,13.04 47.07,13.23 54.24,13.23 55.13,12.45 55.77,12.21 56.03,11.72 56.02,10.93 58.83,10.98 59.33,10.4 59.28,8.74 59.26,8.76 PORT.1
ESC2
  Top 0.203: U2.19 34.6,36.89 35.95,36.89 36.27,39.59 37.68,41 41.3,41 41.44,42.1 42.91,43.26 44.6,44.59 47.42,44.22 48.39,43.34 52.6,43.34 53.71,44.36 56.06,44.36 56.91,43.51 57.63,43.51 59.74,45.62 59.76,45.6 REAR.1
ESC3  (via drill 0.23, 0.23 pad 0.3)
  Top 0.203: 31.56,37.52 31.45,37.47 v31,36.92 | FRONT.1 2.52,10.38 1.37,11.53 1.37,32.56 4.17,35.36 v21.27,35.36
  Top 0.254: 31.56,37.52 31.76,37.68 32.87,37.72 32.87,37.69 32.89,37.67 32.89,37.68 U2.20
  Bottom 0.203: v31,36.92 30.96,37.01 30.62,36.56 29.48,36.11 26.5,36.18 25.22,36.58 24.49,36.46 22.82,36.55 22.47,36.28 v21.27,35.36
ESC4  (via drill 0.23)
  Top 0.203: U2.21 28.68,38.12 v26.48,37.12
  Bottom 0.203: v26.48,37.12 21.48,38.71 20.98,40.62 20.88,40.84 20.34,42.13 12.01,42.09 11.96,43.74 STARBOARD.1
GND  (via drill 0.23)
  Top 0.203: C3.2 5.78,18.19 6.43,18.19 7.48,17.13 U5.18 7.48,17.16 v3.44,17.91 | 10.71,15.04 U5.11 11.44,15.02 11.53,15.11 11.53,15.52 11.96,16.03 11.96,16.24 C4.2 | U5.9 11.95,14.02 C5.2 13.73,13.37 v13.86,13.49 | R25.2 R26.2 | C2.2 20.28,7.22 R17.1 | U6.8 19.66,15.66 21.12,15.66 v21.14,15.63 | C2.2 20.75,9.9 | 19.79,14.45 19.74,14.4 19.72,14.42 19.72,14.48 | C10.2 37.99,39.16 v37.69,38.99 | 54.18,3.48 52.12,1.42 50.37,1.42 R6.1 49.74,2.05 46.45,2.05 v46.43,2.03 | R3.2 59.36,28.14 | 59.36,28.14 R4.2 | 59.36,28.14 R5.2 60.7,26.25 v60.72,26.26 | LIPO.4 42.05,11.9 IC2.1 | U$5.10 | v20.5,49.96 18.81,49.96 R18.1 | U3.4 46.85,30.02 C17.1 | C2.2 21.51,9.89 22.66,10.78 22.67,13.92 21.87,14.36 19.89,14.36 19.82,14.43 19.81,14.43 19.81,14.38 19.82,14.36 19.82,14.37 U6.7 | 53.44,49.95 56.95,49.95 57.35,50.35 57.31,50.35 R16.1 | 16.42,10.71 C12.2 19.06,10.59 C2.2 | R11.2 7.79,11.21 v8.67,11.24 | U5.1 6.68,12.27 v6.57,12.15 | 7.68,6.32 7.6,6.38 | 7.6,6.38 v6.99,7.42 | U6.10 18.08,16.82 v18.91,17.65 | 7.62,4.37 7.54,4.29 7.54,4.27 7.66,4.38 C11.2 7.56,4.5 7.56,4.3 C13.2 7.6,6.38 arc45 7.6,6.38 | C9.2 12.17,10.36 arc45 12.35,10.43 v12.69,10.53 | 12.59,6.59 12.81,7.19 U4.10
  Top 0.254: U2.4 22.59,38.49 C15.1 | U6.8 19.68,14.52 19.72,14.48 | U6.10 U6.11 | IC2.1 IC2.2 IC2.3 IC2.4 | IC1.4 IC1.3 IC1.2 IC1.1 | 19.63,14.4 19.71,14.48 19.72,14.48 | 19.72,14.48 U6.7 | U$9.10 53.44,49.95 v53.44,49.89
  Top 0.406: 16.42,10.71 v15.49,11.7 | U$5.10 v42.57,34.11 42.89,33.79 C8.2 | C17.1 47.89,31.89 v47.48,32.3 | U3.10 39.81,26.5 v39.79,26.48 | U$1.1 32.66,25.41 32.97,25.72 32.97,27.24 33.12,27.39 IC1.1 33.84,27.41 v34.62,26.63 | IC2.4 42.06,15 v42.71,14.35
  Bottom 0.203: v37.69,38.99 37.74,37.29 U7.1 | 20.49,49.95 23.02,49.95 27.89,45.09 JP2.3 | v46.43,2.03 47.24,2.03 47.36,2.15 U$4.2 | 61.82,37.14 U7.20 | 39.91,44.71 39.91,44.51 39.93,40.56 39.24,39.93 v37.69,38.99 | 37.74,38.94 v37.69,38.99 | U7.39 47.8,20.83 | U$3.2 20.49,49.95 | 20.49,49.95 v20.5,49.96 | v60.72,26.26 v60.72,26.25 60.8,26.18 | v13.86,13.49 13.86,13.51 | v15.49,11.7 15.75,11.42 15.72,11.44 | v8.67,11.24 8.09,10.72 8.08,10.71 | v6.57,12.15 6.57,12.08 6.58,12.06 | v6.99,7.42 6.57,7.54 5.88,5.86 | v21.14,15.63 v21.16,15.63 21.17,15.65 | v18.91,17.65 19,17.65 19.05,17.7 | v3.44,17.91 8.22,17.78 8.23,17.79 | v12.69,10.53 12.52,10.59 arc-45 12.61,10.55
  Bottom 0.254: JP2.3 32.02,44.88 JP3.3 35.77,44.81 JP4.3 39.91,44.71 JP5.3 | v53.44,49.89 52.54,49.89 U$9.10
  Bottom 0.406: v42.57,34.11 42.39,34.11 42.32,34.19 | v47.48,32.3 47.51,32.3 47.59,32.22 | v39.79,26.48 39.69,26.58 | v34.62,26.63 34.56,26.63 34.54,26.62 | v42.71,14.35 42.71,14.29 42.75,14.25
  other vias: 10.13,7.16 13.61,25.18 10.07,21.78 35.98,25.01 36.98,22 5.11,24.47 5.52,28.79 7.58,32.49 16.73,31.7 7.3,38.86 2.12,36.53 2.91,44.26 7.66,49.5 41.11,33.26 25.4,49.63 65.77,9.44 63.33,19.04 57.49,4.95 58.05,2.27 23.91,6.79 35.03,1.6 35.38,5.31 17.46,22.96 25.11,47.55 64.68,24.54 65.76,25.58 65.27,43.65 21.77,13.8 60.29,17.64 62.71,21.98 60.49,31.31 65.82,32.05 62.81,8.1 59.59,4.28 26.87,35.2 29.73,35.18 32.5,34.24 38,14.68
  pour Bottom (no thermals): 0.53,51.52 66.32,51.52 66.7,51.14 66.7,1.46 66.23,0.99 1.19,0.99 0.7,1.49 0.7,7.7 0.64,7.76
  pour Top (no thermals): 1.19,51.16 1.19,0.79 arc45 1.27,0.61 1.45,0.43 65.87,0.43 arc45 66.05,0.51 66.99,1.45 66.99,51.13 arc45 66.92,51.31 66.65,51.57 63.62,51.57 arc-45 63.44,51.65 63.42,51.66
GPIO_3V3  (via drill 0.23)
  Top 0.203: v15,43.28 15.01,44.53 LED12.P$1 16.8,44.36 LED11.P$1 16.82,44.35 LED15.P$1 23.46,44.35 C7.1 23.62,43.33 24.21,43.33 24.8,43.03 25.12,41.92 25.6,40.21 25.6,37.1 25.3,36.89 U2.6 | IC1.8 27.76,27.41 | 27.76,27.41 29.07,27.4 30.3,28.52 30.3,31.4 R21.2 | 27.76,27.41 27.56,27.45 26.1,27.46 24.1,29.29 R22.2 25.76,33.16 25.76,33.78 25.77,33.8 U2.9 | U2.9 25.76,33.78 | U2.7 24.35,36.14 25.41,36.14 25.79,35.77 U2.9
  Top 0.254: U2.6 U2.7
  Bottom 0.203: v15,43.28 U$3.9 | U$3.9
GPIO_5V  (via drill 0.23)
  Top 0.203: 32.23,44.09 v32.23,44.25 32.23,46.7 30.94,47.52 30.91,47.55 JP2.2
  Bottom 0.203: 32.19,47.25 31.29,47.25 JP2.2 | U$3.10 12.95,48.44 12.95,45.54 13.18,45.31 14.22,42.57 16.12,42.57 17.95,42.56 18.34,42.56 20.97,42.58 21.92,39.08 26.95,37.91 27.64,36.58 29.17,36.59 29.48,36.91 30.64,38.63 32.46,41.29 v32.23,44.25
  Bottom 0.254: JP5.2 36,47.37 JP4.2 32.19,47.25 JP3.2
GPIO_IRQ  (via drill 0.23)
  Top 0.203: v26.54,39.2 25.76,41.59 25.77,42.3 25.81,42.37 U2.32
  Bottom 0.203: U$3.7 15.79,44.16 17.02,43.64 18.57,43.12 22.62,43.08 23.69,40.92 v26.54,39.2
GPIO_MISO  (via drill 0.23)
  Top 0.203: v30.66,40.87 32.86,40.87 U2.24
  Bottom 0.203: U$3.4 18.27,48.79 18.72,48.44 21.21,48.44 v30.66,40.87
GPIO_MOSI  (via drill 0.23)
  Top 0.203: U2.23 29.38,40.12 29.32,40.1 29.1,39.99 v28.11,39.05
  Bottom 0.203: v28.11,39.05 27,40.18 23.19,44.04 19.81,44.02 18.47,44.49 18.34,45.98 U$3.3
GPIO_RC1
  Top 0.203: U2.25 41.27,42.55 43.93,44.59 44.04,48.93 JP5.1
GPIO_RC2
  Top 0.203: U2.27 29.89,43.48 38.79,43.47 39.89,44.11 39.89,48.4 JP4.1
GPIO_RC3
  Top 0.203: U2.28 28.98,43.51 27.72,45.29 27.72,48.11 28.36,48.85 30.24,48.84 32.99,48.84 JP3.1
GPIO_RC4
  Top 0.203: U2.29 28.19,43.38 26.9,44.83 26.9,49.62 27.7,50.16 JP2.1
GPIO_RST  (via drill 0.23)
  Top 0.203: v23.93,41.96 23.93,41.26 U2.1
  Bottom 0.203: U$3.5 17.04,44.59 19.41,43.59 22.95,43.48 v23.93,41.96
GPIO_SCK  (via drill 0.23)
  Top 0.203: v29.2,38.88 32.85,39.32 U2.22
  Bottom 0.203: U$3.1 19.5,44.95 19.99,44.49 23.37,44.49 v29.2,38.88
GPIO_SCL
  Top 0.203: IC1.6 27.79,28.7 28.8,29.69 28.8,31.3 R21.1 28.19,31.91 U2.12
GPIO_SDA
  Top 0.203: U2.11 27.28,33.69 27.28,32.54 26.24,31.5 R22.1 25.9,30.71 IC1.5
GPIO_SS  (via drill 0.23)
  Top 0.203: 32.75,35.15 U2.17 31.7,35.28 30.76,36.22 v28.88,37.3
  Bottom 0.203: U$3.6 16.8,48.73 16.97,48.03 20.99,48.02 21.2,47.89 22.09,47.19 30.7,39.71 v28.88,37.3
GPIO_STAT1
  Top 0.203: R13.1 16.86,50.33 16.59,50.7 13.17,50.7 12.31,49.82 12.31,46.6 arc-45 12.03,45.89 10.53,45.43 10.54,42.32 arc45 10.71,41.91 10.88,41.5 20.75,41.54 21.11,41.02 21.09,37.06 21.5,36.08 22.42,35.28 23.58,35.27 24.33,35.28 U2.8
GPIO_STAT2  (via drill 0.23)
  Top 0.203: R12.1 13.34,49.84 12.85,49.52 12.87,43.2 arc45 13.08,42.69 13.41,42.09 21.97,42.09 22.5,41.55 v22.52,39.64 | v27.41,38.38 27.36,42.24 27.41,42.29 27.41,42.24 27.51,42.14 27.43,42.14 27.41,42.16 27.41,42.32 27.39,42.33 | 27.39,42.33 27.38,42.34 27.38,42.42 27.3,42.49 | U2.30 27.39,42.33
  Bottom 0.203: v22.52,39.64 26.86,38.43 v27.41,38.38
GPIO_SWIM  (via drill 0.23)
  Top 0.203: v28.54,40.66 30.52,41.56 U2.26
  Bottom 0.203: U$3.8 15.73,48.05 16.05,47.57 20.8,47.57 24.5,44.28 25.35,43.55 v28.54,40.66
GYRO2_IRQ1
  Top 0.203: 14.14,5.68 U4.7 15.41,5.68 15.81,6.08 22.2,6.06 22.63,7.68 25.65,7.63 25.82,7.85 26.16,8 27.28,8.56 27.9,8.23 28.14,8.09 28.14,6.96 28.17,6.93 28.17,6.94 U1.27
GYRO2_IRQ2  (via drill 0.23)
  Top 0.203: U4.6 15.35,5.03 15.82,2.67 21.31,2.67 21.58,3.2 21.58,5.11 v21.54,5.11 | v28.41,9.21 28.96,6.96 U1.28
  Bottom 0.203: v21.54,5.11 22.64,5.11 24.02,5.91 24.11,5.97 24.89,6.4 28.4,6.67 28.77,7.21 v28.41,9.21
GYRO_IRQ  (via drill 0.23)
  Top 0.203: U1.13 28.89,17.46 25.76,20.93 25.23,21.45 v23.86,21.45 | v21.84,21.43 21.84,20.42 21.46,20.04 13.54,20.07 10.73,17.45 U5.12
  Bottom 0.203: v23.86,21.45 22.8,21.43 v21.84,21.43
N$1
  Top 0.203: R14.2 LED18.C
N$3
  Top 0.203: R8.2 23.9,25.65 23.86,25.61 LED1.C
N$4
  Top 0.203: U5.10 12.05,14.52 C4.1
N$5
  Top 0.203: C3.1 5.74,15.19 5.92,15.01 U5.20
N$6
  Top 0.203: LED4.C 52.59,40.66 R1.1
N$7
  Top 0.254: U6.12 16.48,16.35 17.25,17.12 17.25,17.85 C1.1
N$8
  Top 0.254: C1.2 15.66,16.28 U6.13
N$9
  Top 0.254: C2.1 19.62,12.52 U6.6
N$10
  Top 0.203: LED5.C 52.59,42.38 R2.1
N$11
  Top 0.203: R3.1 55.79,29.83 55.78,29.82 | 55.8,29.79 55.78,29.82 | LED6.C 55.78,29.82
N$12
  Top 0.203: R4.1 55.82,28.13 LED7.C
N$13
  Top 0.203: R5.1 55.78,26.25 LED8.C
N$14
  Top 0.254: LED9.C R6.2
N$16
  Top 0.203: LED10.C 35.21,31.27 R7.2
N$17
  Top 0.203: R7.1 35.44,28.04 36.44,28.03 37.34,28.78 43.66,28.78 43.65,28.79 U3.8
N$18
  Top 0.203: R15.2 16.66,3.94 16.71,3.89 16.7,3.89 LED17.C
N$19
  Top 0.203: R18.2 18.73,46.45 LED15.C
N$20
  Top 0.203: R16.2 57.3,47.09 LED2.C
N$21
  Top 0.203: R12.2 15.06,46.51 LED12.C
N$22
  Top 0.203: R13.2 16.88,46.49 LED11.C
N$23  (via drill 0.23)
  Top 0.254: U$9.3 48.72,46.05 v48.73,44.02
  Bottom 0.254: v48.73,44.02 48.73,43.97 U$9.3
N$24
  Top 0.203: R17.2 LED14.C
N$25  (via drill 0.23)
  Top 0.254: v50.02,44.02 50.02,45.62 U$8.5
  Bottom 0.254: U$8.5 50.01,46.05 v50.02,44.02
N$27  (via drill 0.23)
  Top 0.254: U$9.7 51.28,46.05 v51.32,44.03
  Bottom 0.254: v51.32,44.03 51.3,45.03 U$9.7
N$28
  Top 0.203: R20.1 20.57,34.38 U$6.6
N$30
  Top 0.254: C15.2 22.5,36.72 23.39,37.62 24.23,37.62 U2.5
N$31  (via drill 0.23)
  Top 0.254: v53.54,46.1 52.54,46.1 U$9.9
  Bottom 0.254: U$9.9 53.54,46.05 v53.54,46.1
N$32
  Top 0.254: R20.2 LED20.C
N$33
  Top 0.203: U1.5 35.28,11.64 35.48,11.84 35.45,11.87 C16.2
N$34
  Top 0.203: C17.2 U3.5
N$37
  Top 0.203: C14.2 8.52,9.05 R11.1
N$38  (via drill 0.23)
  Top 0.254: v48.72,48.39 48.73,48.87 U$8.8
  Bottom 0.254: U$8.8 48.74,49.95 v48.72,48.39
N$39  (via drill 0.23)
  Top 0.254: U$9.6 50.06,49.42 v50.04,48.36
  Bottom 0.254: v50.04,48.36 50,49.78 U$9.6
N$40  (via drill 0.23)
  Top 0.254: v51.26,48.39 51.27,48.72 U$8.4
  Bottom 0.254: U$8.4 51.28,49.95 v51.26,48.39
N$42
  Top 0.203: C13.1 9.41,6 U4.14 9.35,5.88 9.27,6.48 9.3,7.52 C14.1
N$44  (via drill 0.23)
  other vias: 29.17,11.34
N$45
  Bottom 0.203: 63.34,31.27 63.34,31.25
N$46
  Top 0.203: 39.16,7.82 R19.1
  Top 0.254: LIPO.3 40.09,7.73 39.36,7.86 39.16,7.82
N$47
  Top 0.254: R24.1 41.39,4.56 LIPO.2
N$48
  Top 0.203: 42.2,3.42 LIPO.1
  Top 0.254: R27.1 42.2,3.42
SNSR_3V3  (via drill 0.23)
  Top 0.203: LED17.P$1 18.42,1.67 18.44,1.65 LED18.P$1 18.46,1.62 LED14.P$1 21.53,1.62 22.38,2.48 v23.04,6.1 | U1.6 U1.7 35.14,13.24 C6.1 35.46,13.56 35.46,14.55 36.21,15.31 IC2.8 36.24,15.47 37.62,15.47 38.08,15.93 38.08,17.91 37.31,18.67 R9.2 32.62,18.67 R10.2 31.33,19.67 31.6,22.33 31.34,22.58 31.32,22.55 25.04,22.55 24.75,22.85 LED1.P$1 | v21.63,6.82 22.01,9.41 23.28,10.64 23.25,14.83 23.25,17.54 23.15,17.65 22.66,18.09 U$2.TOP 22.71,19.51 22.71,20.6 | U$6.5 U$6.4 22.16,29.02 LED20.A 22.25,29.01 22.68,28.3 22.86,28.12 22.86,23.65 23.65,22.86 23.88,22.86 23.86,22.85 LED1.P$1 | 22.71,20.6 22.71,22.05 23.51,22.85 LED1.P$1 | U$2.BOTTOM_RIGHT 24.67,20.6 22.71,20.6
  Bottom 0.203: U$7.9 19.71,6.11 v23.04,6.1 23.01,6.24 22.84,6.39 v21.63,6.82
SNSR_5V  (via drill 0.23)
  Top 0.203: SONAR.1 32.12,1.28 24.27,1.31 23.87,1.5 | 23.87,1.5 23.74,1.62 | v23.19,2.08 23.6,1.79 23.87,1.5
  Bottom 0.203: U$7.10 22.39,2.05 v23.19,2.08
SNSR_ECHO
  Top 0.203: U1.25 26.65,6.27 28.68,4.24 28.6,2.5 SONAR.3
SNSR_FAILED  (via drill 0.23)
  Top 0.203: U1.18 25,13.24 24.94,13.16 26.11,13.14 v26.99,12.7 | v17.93,9.79 17.93,8.5 R15.1
  Bottom 0.203: v26.99,12.7 24.17,10.36 18.54,10.41 v17.93,9.79
SNSR_IRQ  (via drill 0.23)
  Top 0.203: U1.32 32.14,6.92 32.16,6.75 32.16,6.02 31.8,5.66 30.38,5.66 29.79,4.62 29.74,2.16 29.16,1.83 25.07,1.8 23.67,3.9 v23.56,4.62
  Bottom 0.203: v23.56,4.62 22.84,4.39 18.85,4.39 18.29,4.75 18.29,5.93 U$7.7
SNSR_MISO  (via drill 0.23)
  Top 0.203: U1.24 24.38,8.53 v22.89,9.22
  Bottom 0.203: v22.89,9.22 22.14,9.11 13.88,9.11 13.25,8.1 13.25,4.28 13.65,3.67 15.37,3.66 15.7,3.4 15.7,2.06 15.72,2.03 U$7.4
SNSR_MOSI  (via drill 0.23)
  Top 0.203: U1.23 25.88,9.29 26.29,9.3 26.73,9.31 v27,9.34
  Bottom 0.203: v27,9.34 26,8.98 23.77,7.58 15.93,7.62 U$7.3
SNSR_PWR_CTL  (via drill 0.23)
  Top 0.203: U1.2 34.62,9.29 v34.82,9.6 | v26.2,18.35 25.46,18.52 U$2.BOTTOM_LEFT
  Bottom 0.203: v34.82,9.6 34.67,18.5 32.98,20.17 32.3,20.17 32.11,20 31.04,18.22 v26.2,18.35
SNSR_RST  (via drill 0.23)
  Top 0.203: U1.1 33.67,7.86 35.13,6.71 34.87,6.71 v35,6.76
  Bottom 0.203: v35,6.76 25.09,5.91 24.11,3.99 17.63,3.99 16.97,4.5 16.97,5.84 17.02,5.89 17.02,5.93 U$7.5
SNSR_SCK  (via drill 0.23)
  Top 0.203: U1.22 25.61,10.2 v27.43,10.21
  Bottom 0.203: v27.43,10.21 26.31,9.98 23.55,8.04 15.6,8.03 14.91,8.01 14.52,7.63 U$7.1
SNSR_SCL  (via drill 0.23)
  Top 0.203: U4.2 12.19,2.65 v10.45,2.64 | v16.48,11.94 16.51,13.13 U6.2 | IC2.6 33.75,16.8 33.68,16.87 33.69,16.87 | R9.1 33.69,16.87 | 33.69,16.87 33.69,15.55 32.38,14.25 30.18,14.25 29.79,14.63 29.79,15.52 29.77,15.54 | U1.12 29.77,15.54 | 29.77,15.54 29.73,17.25 v28.82,19.79 28.86,19.62 U$1.6 | U5.23 5.95,13.52 5.37,12.74 5.36,9.58 5.36,7.29 6.01,5.86 6.59,2.69 v8.72,2.69
  Bottom 0.203: v28.82,19.79 28.33,19.56 27.85,19.43 27.18,19.46 25.54,19.48 24.73,18.95 24.68,13.97 23.61,12.64 21.34,12.64 17.98,12.62 17.23,12.29 16.55,11.98 16.51,11.94 v16.48,11.94 16.56,11.29 16.55,10.16 13.39,10.11 12.31,9 10.9,7.49 v10.45,2.64 arc45 10.41,2.55 v8.72,2.69
SNSR_SDA  (via drill 0.23)
  Top 0.203: IC2.5 34.72,17.45 34.31,17.86 32.11,17.86 | 32.11,17.86 R10.1 31.55,17.79 30.56,16.79 30.56,15.55 U1.11 | 32.11,17.86 31.45,18.01 v30.04,18.96 30.02,19.28 U$1.7 | U6.3 17.28,11.71 v17.3,11.56 | U5.24 6.25,13.02 5.87,12.29 5.87,7.33 6.48,6.1 6.95,3.45 9.22,3.45 9.99,1.94 12.15,1.94 12.76,2.48 12.76,3.37 arc-45 U4.3 12.68,4.53 v11.8,4.65
  Bottom 0.203: v30.04,18.96 29.32,18.96 25.74,18.99 25.45,18.74 arc45 25.18,18.49 25.18,13.88 24,12.28 23.86,12.14 18.44,12.14 18.14,12.13 17.91,12.05 17.39,11.7 v17.3,11.56 17.29,9.97 16.95,9.64 13.68,9.63 13.42,9.36 12.84,8.74 12.1,7.94 arc45 11.94,7.48 v11.8,4.65
SNSR_SS  (via drill 0.23)
  Top 0.203: v28.84,12.92 28.23,12.92 27.89,13.26 24.89,14.2 U1.17
  Bottom 0.203: U$7.6 17,3.42 16.12,4.15 14.03,4.17 13.7,4.46 13.7,7.35 13.99,8.31 14.16,8.56 14.82,8.56 23.24,8.55 27.15,11.21 v28.84,12.92
SNSR_STAT1  (via drill 0.23)
  Top 0.203: R14.1 18.88,8.11 v18.87,9.75 | v31.83,13.41 33.04,14.02
  Bottom 0.203: v18.87,9.75 19.29,9.75 19.41,9.87 24.37,9.86 26.5,11.47 27.33,12.03 28.64,13.7 29.49,13.46 30.28,12.5 30.91,12.5 v31.83,13.41
SNSR_SWIM  (via drill 0.23)
  Top 0.203: v29.39,5.49 28.25,5.74 28.21,5.75 28.11,5.8 27.38,6.2 27.38,6.94 U1.26
  Bottom 0.203: U$7.8 18.27,3.13 18.64,3.58 24.43,3.58 25.36,5.5 27.46,5.65 v29.39,5.49
SNSR_SWITCH_POWER  (via drill 0.23)
  Top 0.203: U4.15 U4.16 | U4.1 U4.16 | 10.78,11.56 C5.1 13.15,11.56 13.87,10.85 14.5,10.82 C12.1 14.81,10.95 14.81,12.5 15.52,13.06 15.6,13.06 | 10.78,11.56 10.77,11.56 C9.1 9.09,10.1 7.35,9.96 6.36,9.78 6.38,9.47 6.36,8.38 8.31,7.68 8.31,5.41 9.41,4.69 C11.1 9.41,4.68 9.41,4.66 9.38,4.69 9.38,4.7 9.71,4.38 U4.16 | 10.78,11.56 11.56,12.34 11.56,13.26 11.38,13.44 11.35,13.44 11.3,13.49 10.76,13.49 10.74,13.51 | U$1.3 27.66,24.56 U$1.4 25.56,23.34 v25.22,23.41 | 10.74,13.51 10.81,13.51 10.17,13.5 9.97,13.91 9.97,15.39 9.98,15.97 U5.13 9.98,17.98 C18.1 | 10.74,13.51 U5.8 | 15.71,14.39 15.07,14.39 14.13,15.33 14.13,18.34 14.52,18.72 21.92,18.72 v21.95,18.75
  Top 0.254: 15.6,13.06 U6.1 15.71,14.39 U6.14
  Bottom 0.203: v21.95,18.75 23.55,18.76 v24.04,19.58 25.17,21.22 v25.22,23.41
SNSR_TRIG
  Top 0.203: SONAR.2 32.41,5.23 33.34,6.36 33.34,7.34 32.46,8.09 31.84,9.35 31.22,9.65 28.96,9.65 27.74,10.85 25.09,10.85 U1.21
SNSR_UART_IN  (via drill 0.23)
  Top 0.203: U$6.2 21.58,23.94 22.02,24.38 22.02,26.92 R8.1 | U1.31 31.27,8.03 v31.42,8.52
  Bottom 0.203: v31.42,8.52 34.87,7.72 36.09,8.1 35.79,18.91 30.12,24.83 23,24.96 20.93,23.94 U$6.2
SNSR_UART_OUT  (via drill 0.23)
  Top 0.203: v30.53,8.79 30.45,7.19 U1.30
  Bottom 0.203: U$6.1 23.22,24.33 24.51,24.33 29.83,24.32 35.2,18.77 35.48,9.11 34.53,8.84 31.93,9.42 v30.53,8.79
WIFI_3V3  (via drill 0.23)
  Top 0.203: v52.54,7.73 50.34,6.99 LED9.P$1 | v36.99,31.5 44.27,29.92 | 44.27,29.92 44.48,29.72 44.48,28.82 U3.7 | 44.27,29.92 44.27,29.9 44.69,30.32 C8.1 44.69,31.48 45.61,32.31 46.91,33.62 v46.91,34.62 | v48.06,39.24 43.73,39.26 C10.1 | 49.76,42.03 47.13,42.03 46.91,42.24 ADHOC.1 | LED5.P$1 49.76,42.03 | 49.76,42.03 LED4.P$1 49.69,39.92 48.9,39.22 48.13,39.27 v48.06,39.24 | U3.6 45.25,27.64 v45.36,27.53 | v52.32,23.13 54.2,21.92 v54.2,18.47 54.23,15.52 52.27,13.56 arc45 52.2,13.38 52.2,13.32 52.21,8.19 52.45,7.85 52.5,7.8 52.5,7.75 v52.54,7.73 | v48.06,39.24 48.04,38.53 48.04,33.12 48.72,32 48.73,30.44 50.62,31.22 57.14,31.23 61.48,37.2 62.06,37.11 U$5.1 | LED10.P$1 36.89,31.57 v36.99,31.5 | C20.1 52.55,6.18 52.55,7.66 | v52.54,7.73 52.54,7.66 52.55,7.66 | 52.55,7.66 52.55,7.73 | C19.1 36.99,32.31 v36.99,31.5
  Top 0.254: U3.6 U3.7
  Bottom 0.203: U$4.9 52.49,7.59 v52.54,7.73 | U7.49 36.99,31.32 v36.99,31.5 | v48.06,39.24 49.07,38.81 U7.10 49.15,37.11 48.7,35.84 47.38,35.37 v46.91,34.62 | v54.2,18.47 54.2,18.52 U7.34 | v45.36,27.53 49.61,27.53 v52.32,23.13
WIFI_ADHOC
  Top 0.203: U$5.9 46.22,37.97 43.05,37.96 42.49,38.35 42.49,39.88 42.82,40.21 44.27,40.21 44.45,40.39 44.45,42.24 44.4,42.24 ADHOC.2
  Bottom 0.203: ADHOC.2 42.04,42.22 41.1,40.79 41.48,37.39 41.45,37.13 U7.4
WIFI_CONN_STAT  (via drill 0.23)
  Top 0.203: v50.66,28.21 52.07,27.86 LED8.P$1
  Bottom 0.203: U7.7 45.19,30.86 46.1,28.45 49.91,28.3 v50.66,28.21
WIFI_CTS  (via drill 0.23)
  Top 0.203: 47.07,15.11 U$5.12 47.08,16.38 v45.05,18.41 | U3.27 44.46,23.3 v44.45,23.32
  Bottom 0.203: v45.05,18.41 44.78,18.69 42.15,18.62 41.66,19.33 U7.44 41.48,20.19 41.48,22.78 42.01,23.32 v44.45,23.32
WIFI_IRQ  (via drill 0.23)
  Top 0.203: v54.37,11.02 54.15,10.9 55.61,10.85 56.16,11.32 56.19,24.33 55.36,25.16 53.19,25.16 52.35,25.78 52.35,26.52 51.59,27.28 50.77,27.28 U3.32
  Bottom 0.203: U$4.7 51.27,8.81 53.14,10.97 v54.37,11.02
WIFI_MISO  (via drill 0.23)
  Top 0.203: v46.69,3.81 48.28,7.16 48.27,8.62 48.27,13.21 49.33,15.54 49.33,20.14 U3.24
  Bottom 0.203: U$4.4 48.73,3.65 v46.69,3.81
WIFI_MOSI  (via drill 0.23)
  Top 0.203: v47.4,8.69 47.75,9.38 47.74,11.3 47.73,13.34 48.54,15.43 48.54,20.12 U3.23
  Bottom 0.203: U$4.3 48.73,7.96 v47.4,8.69
WIFI_RESET  (via drill 0.23)
  Top 0.203: v47.62,22.5 49.05,22.5 50.16,21.74 50.71,21.67 U3.25 | U$5.5 51.4,35.22 v49.34,32.31
  Bottom 0.203: U7.40 46.53,21.03 47.22,21.72 47.22,21.74 v47.62,22.5 47.68,22.45 47.18,21.72 54.2,21.75 53.03,30.12 v49.34,32.31
WIFI_RST  (via drill 0.23)
  Top 0.203: v50,8.56 50.11,20.89 49.05,21.74 44.7,21.74 43.76,22.68 43.76,25.17 45.01,26.42 46.87,26.42 49.2,27.86 U3.1
  Bottom 0.203: U$4.5 50.02,8.43 v50,8.56
WIFI_RTS  (via drill 0.23)
  Top 0.203: U$5.16 55.08,22.4 52.93,24.03 50.76,24.03 U3.28 49.05,24.1 v48.97,24.03
  Bottom 0.203: v48.97,24.03 45.77,22.89 43.03,22.2 U7.43
WIFI_RXTX  (via drill 0.23)
  Top 0.203: LED7.P$1 52.98,28.12 v51.8,28.7
  Bottom 0.203: v51.8,28.7 50.76,28.91 50.14,28.84 46.38,29.02 45.74,31.04 45.72,35.46 46.29,35.85 46.33,36.98 U7.8
WIFI_SCK  (via drill 0.23)
  Top 0.203: v46.56,8.13 46.56,13.08 44.28,14.57 44.32,19.04 47.65,19.21 U3.22
  Bottom 0.203: U$4.1 47.46,7.23 v46.56,8.13
WIFI_SS  (via drill 0.23)
  Top 0.203: U3.17 43.75,20.11 43.75,19.32 43.73,13.85 v43.62,12.46
  Bottom 0.203: v43.62,12.46 44.59,12.61 45.52,12.01 45.41,5.99 46.84,4.45 49.48,4.39 49.96,3.91 49.96,2.09 U$4.6
WIFI_SWIM  (via drill 0.23)
  Top 0.203: v51.41,10.71 51.41,13.42 arc-45 51.48,13.6 52.26,14.38 52.26,22.04 51.92,22.45 50.8,22.45 U3.26
  Bottom 0.203: U$4.8 51.27,3.52 51.71,3.96 54.79,3.96 55.47,4.88 55.46,11.71 52.01,11.7 51.41,10.88 v51.41,10.71
WIFI_TCP  (via drill 0.23)
  Top 0.203: v51.05,29.64 53.67,29.79 | 53.67,29.79 53.7,29.77 | LED6.P$1 53.68,29.8 53.67,29.79
  Bottom 0.203: U7.9 47.8,36.16 46.14,35.15 46.22,31.17 46.72,29.49 50.11,29.26 v51.05,29.64
WIFI_UART_IN  (via drill 0.23)
  Top 0.203: R1.2 54.07,41.08 54.08,43.22 54.5,43.59 55.41,43.59 55.82,43.34 57.29,42.51 58.71,41.73 | 58.57,41.81 58.71,41.73 | 58.71,41.73 62.66,41.73 65.43,38.96 65.43,35.13 64.41,34.11 U$5.2 59.92,34.11 57.51,30.8 50.91,30.77 50.49,29.98 50.27,29.13 49.73,27.74 49.67,26.67 | 49.67,26.67 49.96,26.42 50.66,26.42 U3.31 | v48.97,26.67 49.67,26.67
  Bottom 0.203: U7.46 38.91,23.88 40.28,25.25 47.55,25.25 v48.97,26.67
WIFI_UART_OUT  (via drill 0.23)
  Top 0.203: R2.2 56.2,42.43 57.4,41.55 57.4,39.34 57.04,38.98 | 59.08,37.03 59.03,37.08 59.06,37.11 U$5.3 58.91,37.11 | v48.97,25.7 U3.30 51.56,25.7 52.43,24.92 v52.5,24.79 | 57.02,38.96 57.04,38.98 | 58.91,37.11 57.04,38.98 | 58.91,37.11 58.91,34.6 56.78,31.69 53.14,31.67 50.16,31.67 v49.39,31.45
  Bottom 0.203: U7.45 40.21,23.39 40.23,23.48 41.35,24.56 47.83,24.56 v48.97,25.7 | v49.39,31.45 50.69,30.44 52.29,30.04 52.84,26.1 v52.5,24.79

### Text on the board
tNames: THROTTLE | PWM-IN | +5V | GND | GND | GND | WHT | YAW | ROLL | PITCH | WHT | GND | GND | WHT | GND | WHT | C1 | GND | ECHO | TGR | +5V | C2 | NiVek | GO! QC1 | C3 | REV B